# Altium schematic sheet Amplifier.SchDoc
size A; SheetNumber: 2; SheetTotal: 4
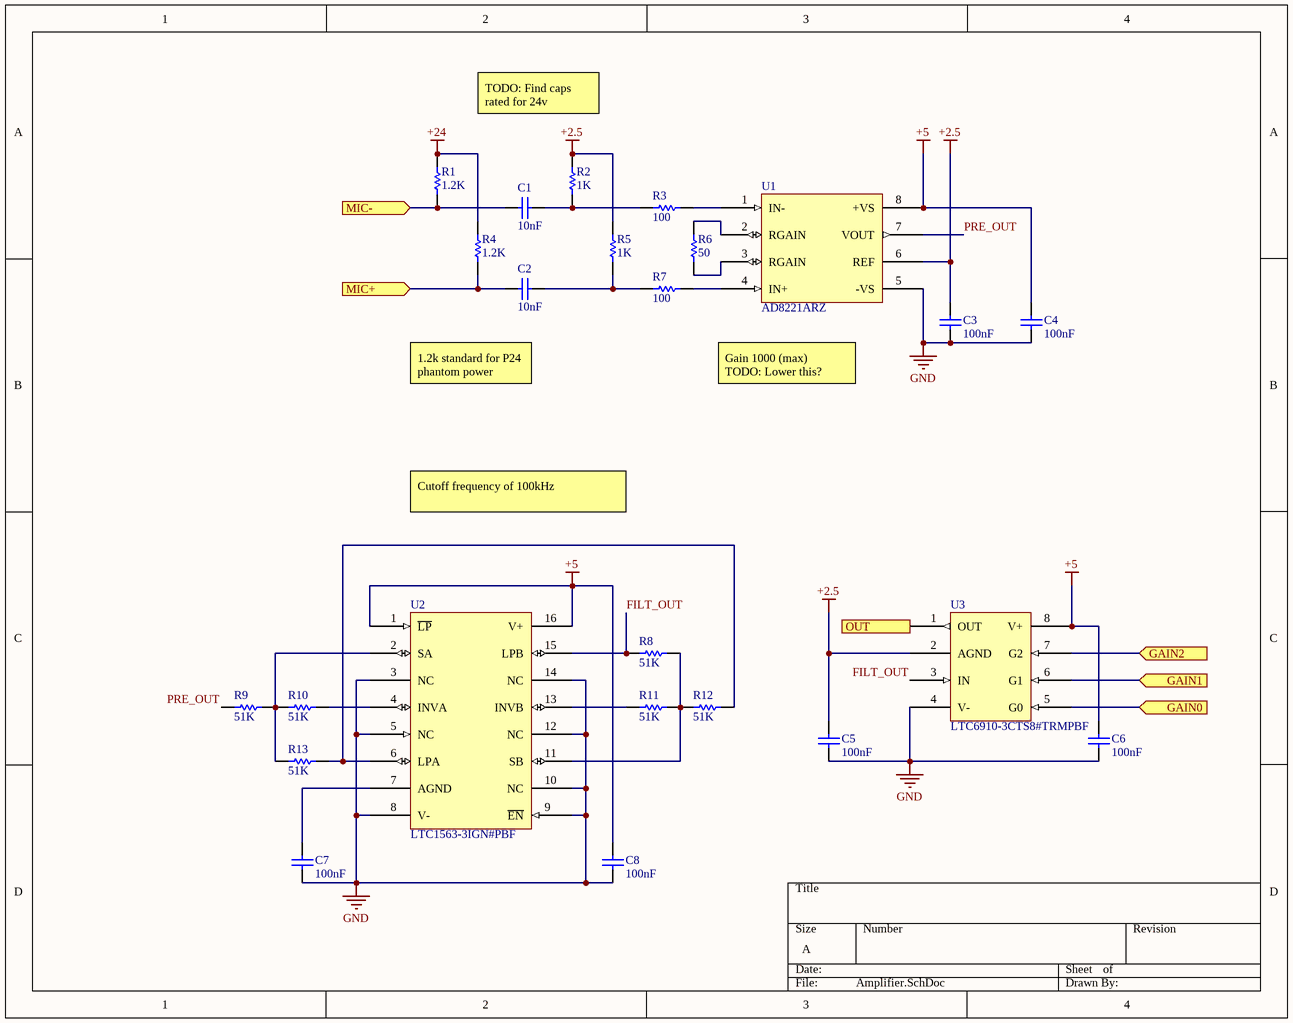
[diagram p0: Amplifier.SchDoc]

## Parts
C1  10nF  [CAPC1608X10M]
C2  10nF  [CAPC1608X10M]
C3  100nF  [CAPC1608X10M]
C4  100nF  [CAPC1608X10M]
C5  100nF  [CAPC1608X10M]
C6  100nF  [CAPC1608X10M]
C7  100nF  [CAPC1608X10M]
C8  100nF  [CAPC1608X10M]
R1  1.2K  [RESC1608X06M]
R2  1K  [RESC1608X06M]
R3  100  [RESC1608X06M]
R4  1.2K  [RESC1608X06M]
R5  1K  [RESC1608X06M]
R6  50  [RESC1608X06M]
R7  100  [RESC1608X06M]
R8  51K  [RESC1608X06M]
R9  51K  [RESC1608X06M]
R10  51K  [RESC1608X06M]
R11  51K  [RESC1608X06M]
R12  51K  [RESC1608X06M]
R13  51K  [RESC1608X06M]
U1  AD8221ARZ  [SOIC127P600X150-8M]
U2  LTC1563-3IGN#PBF  [SOP64P600X175-16M]
U3  LTC6910-3CTS8#TRMPBF  [TSOP65P280X100-8M]

## Ports
GAIN0 (in), GAIN1 (in), GAIN2 (in), MIC+ (in), MIC- (in), OUT (out)

## Nets
+2.5: C3.2 C5.2 R2.2 R5.2 U1.6(REF) U3.2(AGND)
+5: C4.2 C6.2 C8.2 U1.8(+VS) U2.1(~{LP}) U2.16(V+) U3.8(V+)
+24: R1.2 R4.2
GND: C3.1 C4.1 C5.1 C6.1 C7.1 C8.1 U1.5(-VS) U2.3(NC) U2.5(NC) U2.8(V-) U2.9(~{EN}) U2.10(NC) U2.12(NC) U2.14(NC) U3.4(V-)
FILT_OUT: R8.2 U2.15(LPB) U3.3(IN)
GAIN0: U3.5(G0) ; port GAIN0
GAIN1: U3.6(G1) ; port GAIN1
GAIN2: U3.7(G2) ; port GAIN2
MIC+: C2.1 R4.1 ; port MIC+
MIC-: C1.1 R1.1 ; port MIC-
OUT: U3.1(OUT) ; port OUT
PRE_OUT: R9.2 U1.7(VOUT)
NetC1_2: C1.2 R2.1 R3.2
NetC2_2: C2.2 R5.1 R7.2
NetC7_2: C7.2 U2.7(AGND)
NetR3_1: R3.1 U1.1(IN-)
NetR6_1: R6.1 U1.3(RGAIN)
NetR6_2: R6.2 U1.2(RGAIN)
NetR7_1: R7.1 U1.4(IN+)
NetR8_1: R8.1 R11.1 R12.2 U2.11(SB)
NetR9_1: R9.1 R10.2 R13.1 U2.2(SA)
NetR10_1: R10.1 U2.4(INVA)
NetR11_2: R11.2 U2.13(INVB)
NetR12_1: R12.1 R13.2 U2.6(LPA)

## Notes on the sheet
- TODO: Find caps rated for 24v
- 1.2k standard for P24 phantom power
- Gain 1000 (max)
  TODO: Lower this?
- Cutoff frequency of 100kHz

## Library data of the parts
C1-C8 = GRM188: GRM188 0603(1.6mm*0.8mm) ±5% and ±10% (15pF-2.2uF) SMD Capacitor; Published: 8-Jun-2000; LatestRevisionDate: 17-Jul-2002; LatestRevisionNote: Re-released for DXP Platform.; PackageReference: RAD-0.3; Publisher: Altium Limited; PackageDescription: Radial Cap, Thru-Hole; 2 Leads; 0.3 in Pin Spacing
R1-R13 = RC0603_JR07: RC0603 JR-07 0603 (1.6mm*0.8mm) ±1% 1% (0R-4.7MR) chip resistor; Published: 8-Jun-2000; LatestRevisionDate: 17-Jul-2002; LatestRevisionNote: Re-released for DXP Platform.; PackageReference: AXIAL-0.3; Publisher: Altium Limited; PackageDescription: Axial Device, Thru-Hole; 2 Leads; 0.3 in Pin Spacing
U1 = AD8221ARZ: IC INST AMP 1 CIRCUIT 8SOIC; ComponentLink1Description: New link; ComponentLink1URL: https://www.analog.com/media/en/technical-documentation/data-sheets/AD8221.pdf
U2 = LTC1563-3IGN#PBF: IC FILTER 256KHZ LOWPASS BESSEL 16SSOP; ComponentLink1Description: Datasheet; ComponentLink1URL: https://www.analog.com/media/en/technical-documentation/data-sheets/156323fa.pdf
U3 = LTC6910-3CTS8#TRMPBF: Programmable Gain Amplifier 1 Circuit Rail-to-Rail TSOT-23-8; ComponentLink1Description: Datasheet; ComponentLink1URL: https://www.analog.com/media/en/technical-documentation/data-sheets/6910fb.pdf